# Altium schematic sheet [01] - COVER PAGE.SchDoc
size A3
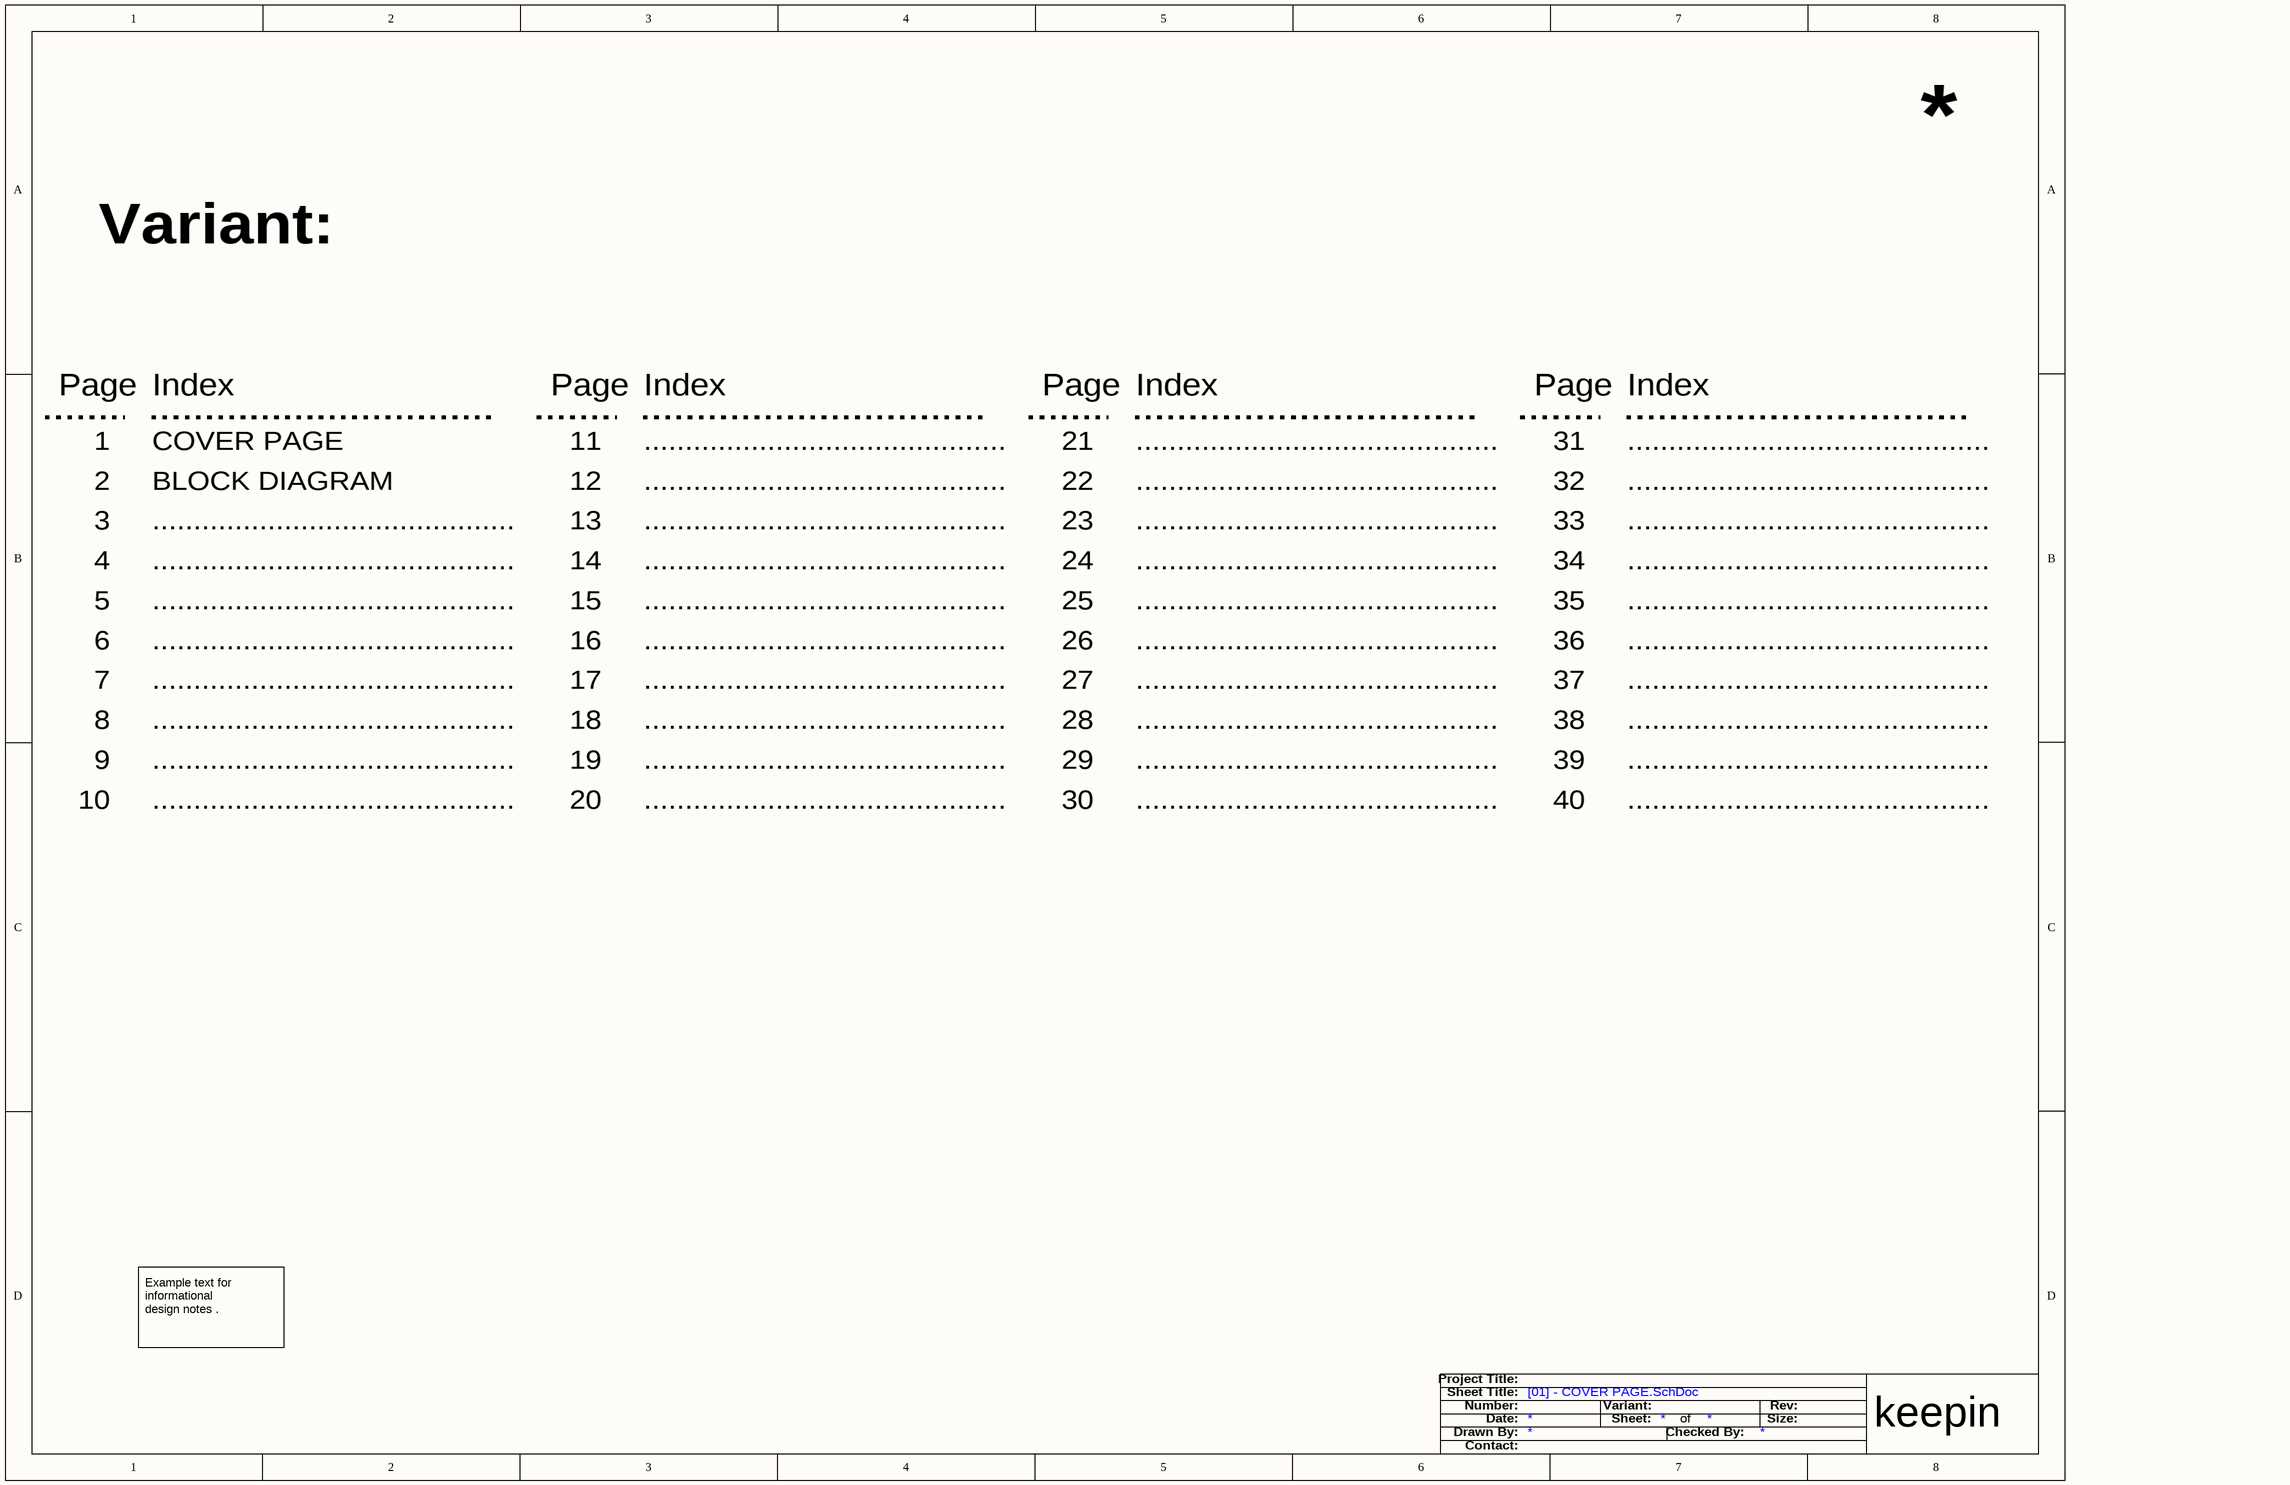
[diagram p0: [01] - COVER PAGE.SchDoc]

## Notes on the sheet
- Variant:
- Page
- Index
- 1
- 2
- COVER PAGE
- BLOCK DIAGRAM
- 11
- 12
- ............................................
- 21
- 22
- 31
- 32
- 3
- 4
- 13
- 14
- 23
- 24
- 33
- 34
- 5
- 15
- 25
- 35
- 6
- 7
- 16
- 17
- 26
- 27
- 36
- 37
- 8
- 9
- 18
- 19
- 28
- 29
- 38
- 39
- 10
- 20
- 30
- 40
- Example text for informational
  design notes .
- Project Title:
- Number:
- Date:
- Sheet Title:
- Drawn By:
- Sheet:
- of
- Checked By:
- Rev:
- Size:
- keepin
- Contact: